# Altium schematic sheet MB1297_RF_Module.SchDoc: RF Modules
size A4; DocumentNumber: MB1297; Revision: D; SheetNumber: 5; SheetTotal: 11
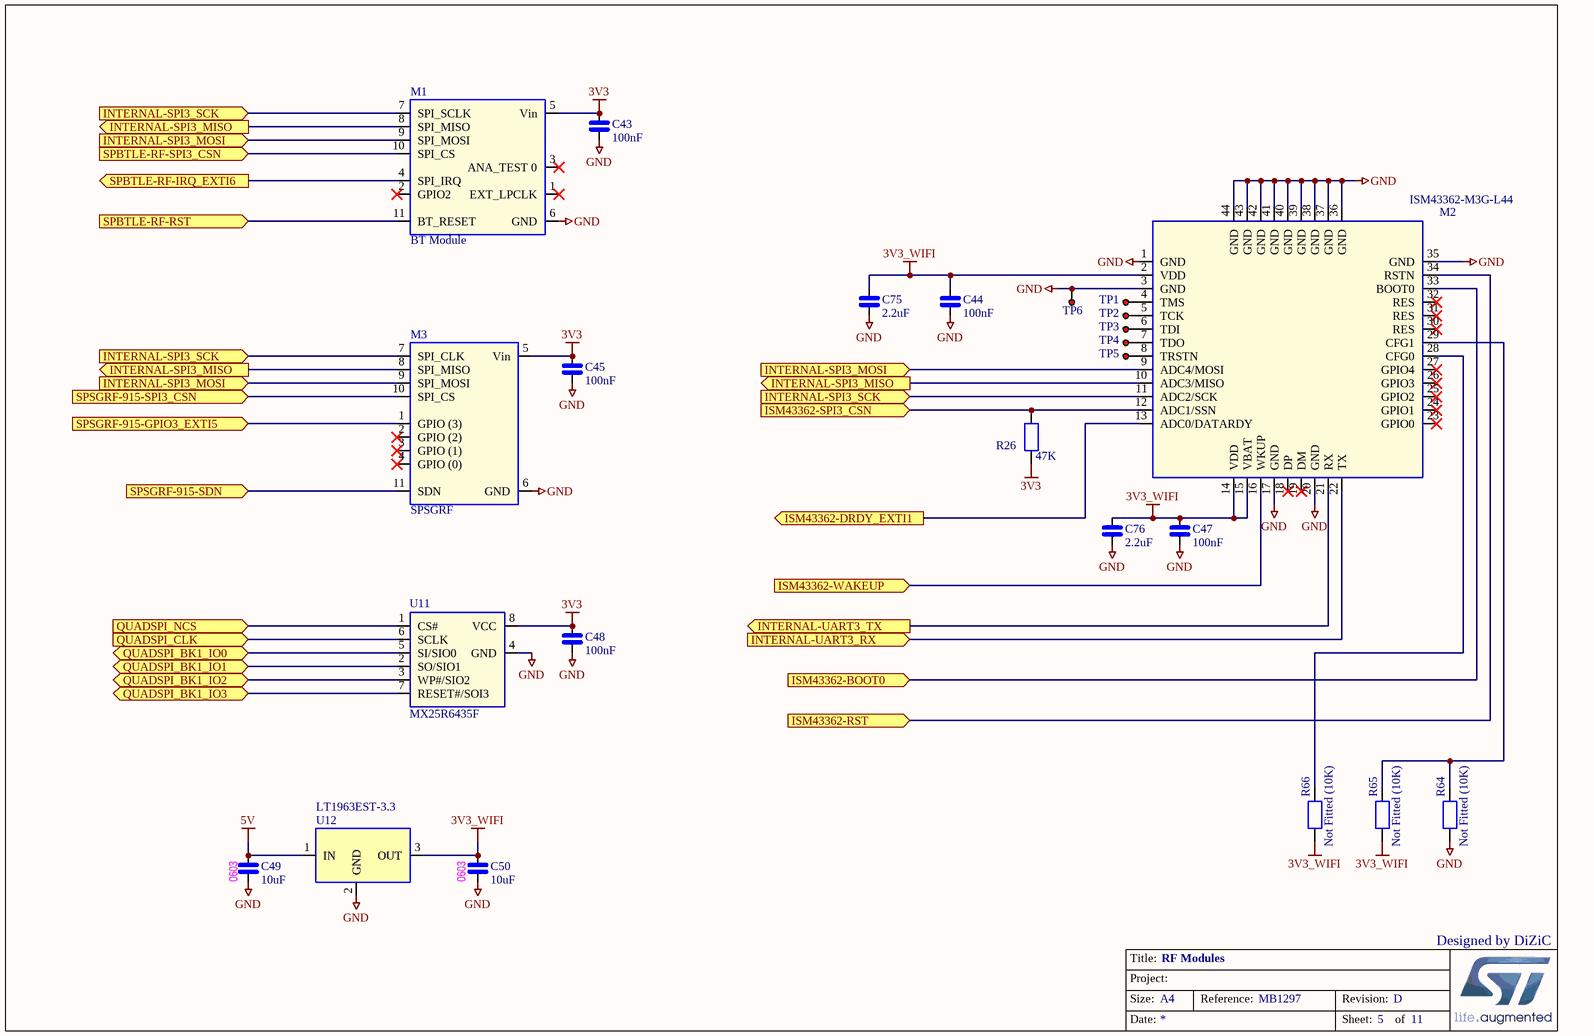
[diagram p0: MB1297_RF_Module.SchDoc]

## Parts
C43  100nF  [0402_CAP_NPOL]
C44  100nF  [0402_CAP_NPOL]
C45  100nF  [0402_CAP_NPOL]
C47  100nF  [0402_CAP_NPOL]
C48  100nF  [0402_CAP_NPOL]
C49  10uF  [0603_CAP_NPOL]
C50  10uF  [0603_CAP_NPOL]
C75  2.2uF  [0603_CAP_NPOL]
C76  2.2uF  [0603_CAP_NPOL]
M1  BT Module  [SPBTLE-RF]
M2  ISM43362-M3G-L44  [ISM43362-M3G-L44]
M3  SPSGRF  [SPSGRF]
R26  47K  [0402_RES]
R64  Not Fitted (10K)  [0402_RES]
R65  Not Fitted (10K)  [0402_RES]
R66  Not Fitted (10K)  [0402_RES]
TP1  PT  [PTB]  (value not drawn)
TP2  PT  [PTB]  (value not drawn)
TP3  PT  [PTB]  (value not drawn)
TP4  PT  [PTB]  (value not drawn)
TP5  PT  [PTB]  (value not drawn)
TP6  PT  [PTB]  (value not drawn)
U11  MX25R6435F  [SOP8L]
U12  LT1963EST-3.3  [SOT223_SC73]

## Ports
INTERNAL-SPI3_MISO, INTERNAL-SPI3_MOSI, INTERNAL-SPI3_SCK, INTERNAL-UART3_RX, INTERNAL-UART3_TX, ISM43362-BOOT0, ISM43362-DRDY_EXTI1, ISM43362-RST, ISM43362-SPI3_CSN, ISM43362-WAKEUP, QUADSPI_BK1_IO0, QUADSPI_BK1_IO1, QUADSPI_BK1_IO2, QUADSPI_BK1_IO3, QUADSPI_CLK, QUADSPI_NCS, SPBTLE-RF-IRQ_EXTI6, SPBTLE-RF-RST, SPBTLE-RF-SPI3_CSN, SPSGRF-915-GPIO3_EXTI5, SPSGRF-915-SDN, SPSGRF-915-SPI3_CSN

## Nets
3V3: C43.1 C45.1 C48.1 M1.5(Vin) M3.5(Vin) R26.2 U11.8(VCC)
3V3_WIFI: C44.1 C47.1 C50.1 C75.1 C76.1 M2.2(VDD) M2.14(VDD) M2.15(VBAT) R65.2 R66.2 U12.3(OUT)
5V: C49.1 U12.1(IN)
GND: C43.2 C44.2 C45.2 C47.2 C48.2 C49.2 C50.2 C75.2 C76.2 M1.6(GND) M2.1(GND) M2.3(GND) M2.17(GND) M2.20(GND) M2.35(GND) M2.36(GND) M2.37(GND) M2.38(GND) M2.39(GND) M2.40(GND) M2.41(GND) M2.42(GND) M2.43(GND) M2.44(GND) M3.6(GND) R64.2 TP6.1 U11.4(GND) U12.2(GND)
INTERNAL-SPI3_MISO: M1.8(SPI_MISO) M2.10(ADC3/MISO) M3.8(SPI_MISO) ; port INTERNAL-SPI3_MISO
INTERNAL-SPI3_MOSI: M1.9(SPI_MOSI) M2.9(ADC4/MOSI) M3.9(SPI_MOSI) ; port INTERNAL-SPI3_MOSI
INTERNAL-SPI3_SCK: M1.7(SPI_SCLK) M2.11(ADC2/SCK) M3.7(SPI_CLK) ; port INTERNAL-SPI3_SCK
INTERNAL-UART3_RX: M2.22(TX) ; port INTERNAL-UART3_RX
INTERNAL-UART3_TX: M2.21(RX) ; port INTERNAL-UART3_TX
ISM43362-BOOT0: M2.33(BOOT0) ; port ISM43362-BOOT0
ISM43362-DRDY_EXTI1: M2.13(ADC0/DATARDY) ; port ISM43362-DRDY_EXTI1
ISM43362-RST: M2.34(RSTN) ; port ISM43362-RST
ISM43362-SPI3_CSN: M2.12(ADC1/SSN) R26.1 ; port ISM43362-SPI3_CSN
ISM43362-WAKEUP: M2.16(WKUP) ; port ISM43362-WAKEUP
QUADSPI_BK1_IO0: U11.5(SI/SIO0) ; port QUADSPI_BK1_IO0
QUADSPI_BK1_IO1: U11.2(SO/SIO1) ; port QUADSPI_BK1_IO1
QUADSPI_BK1_IO2: U11.3(WP#/SIO2) ; port QUADSPI_BK1_IO2
QUADSPI_BK1_IO3: U11.7(RESET#/SOI3) ; port QUADSPI_BK1_IO3
QUADSPI_CLK: U11.6(SCLK) ; port QUADSPI_CLK
QUADSPI_NCS: U11.1(CS#) ; port QUADSPI_NCS
SPBTLE-RF-IRQ_EXTI6: M1.4(SPI_IRQ) ; port SPBTLE-RF-IRQ_EXTI6
SPBTLE-RF-RST: M1.11(BT_RESET) ; port SPBTLE-RF-RST
SPBTLE-RF-SPI3_CSN: M1.10(SPI_CS) ; port SPBTLE-RF-SPI3_CSN
SPSGRF-915-GPIO3_EXTI5: M3.1(GPIO_(3)) ; port SPSGRF-915-GPIO3_EXTI5
SPSGRF-915-SDN: M3.11(SDN) ; port SPSGRF-915-SDN
SPSGRF-915-SPI3_CSN: M3.10(SPI_CS) ; port SPSGRF-915-SPI3_CSN
NetM2_4: M2.4(TMS) TP1.1
NetM2_5: M2.5(TCK) TP2.1
NetM2_6: M2.6(TDI) TP3.1
NetM2_7: M2.7(TDO) TP4.1
NetM2_8: M2.8(TRSTN) TP5.1
NetM2_28: M2.28(CFG0) R66.1
NetM2_29: M2.29(CFG1) R64.1 R65.1

Not connected (* = marked no-connect by the designer): M1 1(EXT_LPCLK)* 2(GPIO2)* 3(ANA_TEST_0)*; M2 18(DP)* 19(DM)* 23(GPIO0)* 24(GPIO1)* 25(GPIO2)* 26(GPIO3)* 27(GPIO4)* 30(RES)* 31(RES)* 32(RES)*; M3 2(GPIO_(2))* 3(GPIO_(1))* 4(GPIO_(0))*

## Notes on the sheet
- (near C49) 0603
- (near C50) 0603
- Designed by DiZiC
- Title:
- Project:
- Size:
- Date:
- A4
- Reference:
- Sheet:
- Revision:
- of

## Library data of the parts
C43-C45 C47-C50 C75 C76 = CAP_NPOL: Capacitor_not polarized
M1 = SPBTLE-RF
M2 = ISM43362-M3G-L44: ISM43362-M3G-L44 Wifi Module 802.11 bgn
M3 = SPSGRF: SPSGRF-915or SPSGRF-868
R26 = RES: Resistor
R64-R66 = RES: Resistor; FITTED: NO
TP1-TP6 = PT: Point de test
U11 = MX25R6435F: MX25R6435F Serial Flash Memory 64M
U12 = LT1963EST-3.3: LT1963EST-3.3 LDO Low Noise 1.5A fast Transient Response